# Altium schematic sheet Power.SchDoc
size A4; SheetNumber: 3; SheetTotal: 3
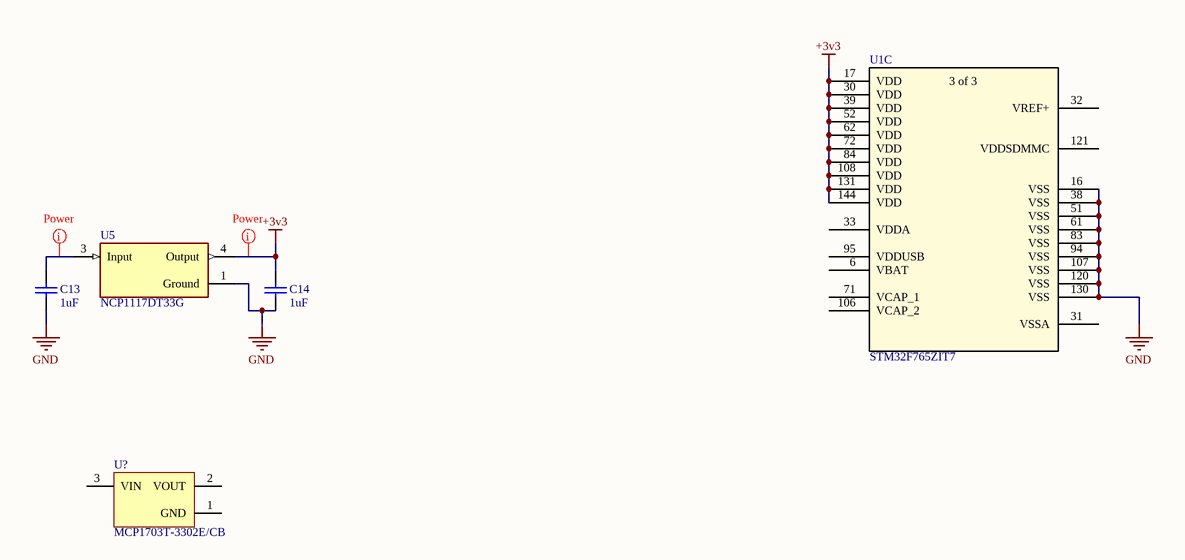
[diagram p0: Power.SchDoc]

## Parts
C13  1uF  [RAD-0.3]
C14  1uF  [RAD-0.3]
U1  STM32F765ZIT7  [LQFP-144_STM-M]  (part C of 3)
U5  NCP1117DT33G  [FP-369C-MFG]
U?  MCP1703T-3302E/CB  [SOT-23A-CB3_M]

## Nets
+3v3: C14.2 U1.17(VDD) U1.30(VDD) U1.39(VDD) U1.52(VDD) U1.62(VDD) U1.72(VDD) U1.84(VDD) U1.108(VDD) U1.131(VDD) U1.144(VDD) U5.4(Output)
GND: C13.1 C14.1 U1.16(VSS) U1.38(VSS) U1.51(VSS) U1.61(VSS) U1.83(VSS) U1.94(VSS) U1.107(VSS) U1.120(VSS) U1.130(VSS) U5.1(Ground)
NetC13_2: C13.2 U5.3(Input)

Not connected (* = marked no-connect by the designer): U1 6(VBAT) 31(VSSA) 32(VREF+) 33(VDDA) 71(VCAP_1) 95(VDDUSB) 106(VCAP_2) 121(VDDSDMMC); U? 1(GND) 2(VOUT) 3(VIN)

## Layout directives
net class Power; net class Power: NetC13_2
net class Power: +3v3

## Notes on the sheet
- (in symbol STM32F765ZIT7, part C) 3 of 3

## Library data of the parts
C13 C14 = Cap: Capacitor; Value: 100pF; Published: 8-Jun-2000; LatestRevisionDate: 17-Jul-2002; LatestRevisionNote: Re-released for DXP Platform.; PackageReference: RAD-0.3; Publisher: Altium Limited; PackageDescription: Radial Cap, Thru-Hole; 2 Leads; 0.3 in Pin Spacing
U1 = STM32F765ZIT7: No Description Available; Built_By: EMA_Jessica; Vendor: STMicroelectronics; SourceLibrary: Add_to_database_2020-10-19; Copyright: Copyright (C) 2018 Accelerated Designs. All rights reserved; Manufacturer_Part_Number: STM32F765ZIT7; RefDes: RefDes; Type: DEV
U5 = CMP-07128-000008-1: IC REG LINEAR 3.3V 1A DPAK; Manufacturer: ON Semiconductor; Dropout Voltage: 1.2V; Nominal Supply Current: 6mA; Number Of Outputs: 1; Max Supply Voltage: 20V; Max Junction Temp: +150°C; Min Supply Voltage: 2.4V; Accuracy Percentage: 1%; Output Type: Fixed; Standoff Height: 0mm; Package: 369C; Lead Free: Yes; Temperature Range Low: -55°C; Automotive: No; Digikey Description: IC REG LINEAR 3.3V 1A DPAK; ComponentLink2Description: Datasheet; Footprint Url: https://www.onsemi.com/pub/Collateral/369C.PDF; Output Voltage: 3.3V; Manufacturer Part Number: NCP1117DT33G; Device Class L2: Power Management ICs; RoHS: TRUE; Device Class L3: Voltage Regulators - Linear; Mouser Description: LDO Voltage Regulators 3.3V 1A Positive; Output Current: 1A; Ambient Temperature Range Low: 0°C; Height: 2.51mm; Octopart: https://octopart.com/ncp1117dt33g-on+semiconductor-1381653; Temperature Range High: +150°C; Temperature: -55°C to +150°C; Device Class L1: Integrated Circuits (ICs); ComponentLink2URL: https://www.onsemi.jp/PowerSolutions/document/NCP1117-D.PDF; Ambient Temperature Range High: +125°C; Category: IC
U? = CMP-0136-00759-1: 250 mA, 16V, Low Quiescent Current LDO Regulator, 3-Pin SOT-23A, Extended Temperature, Tape and Reel; PackageDescription: 3-Lead Plastic Small Outline Transistor (CB) [SOT-23A]; PackageVersion: revBB, Aug-2009; PackageReference: SOT-23A-CB3; DatasheetVersion: revD, Sep-2009